# EAGLE design 5V-3.3VSupply_USB (EAGLE 7.2.0)
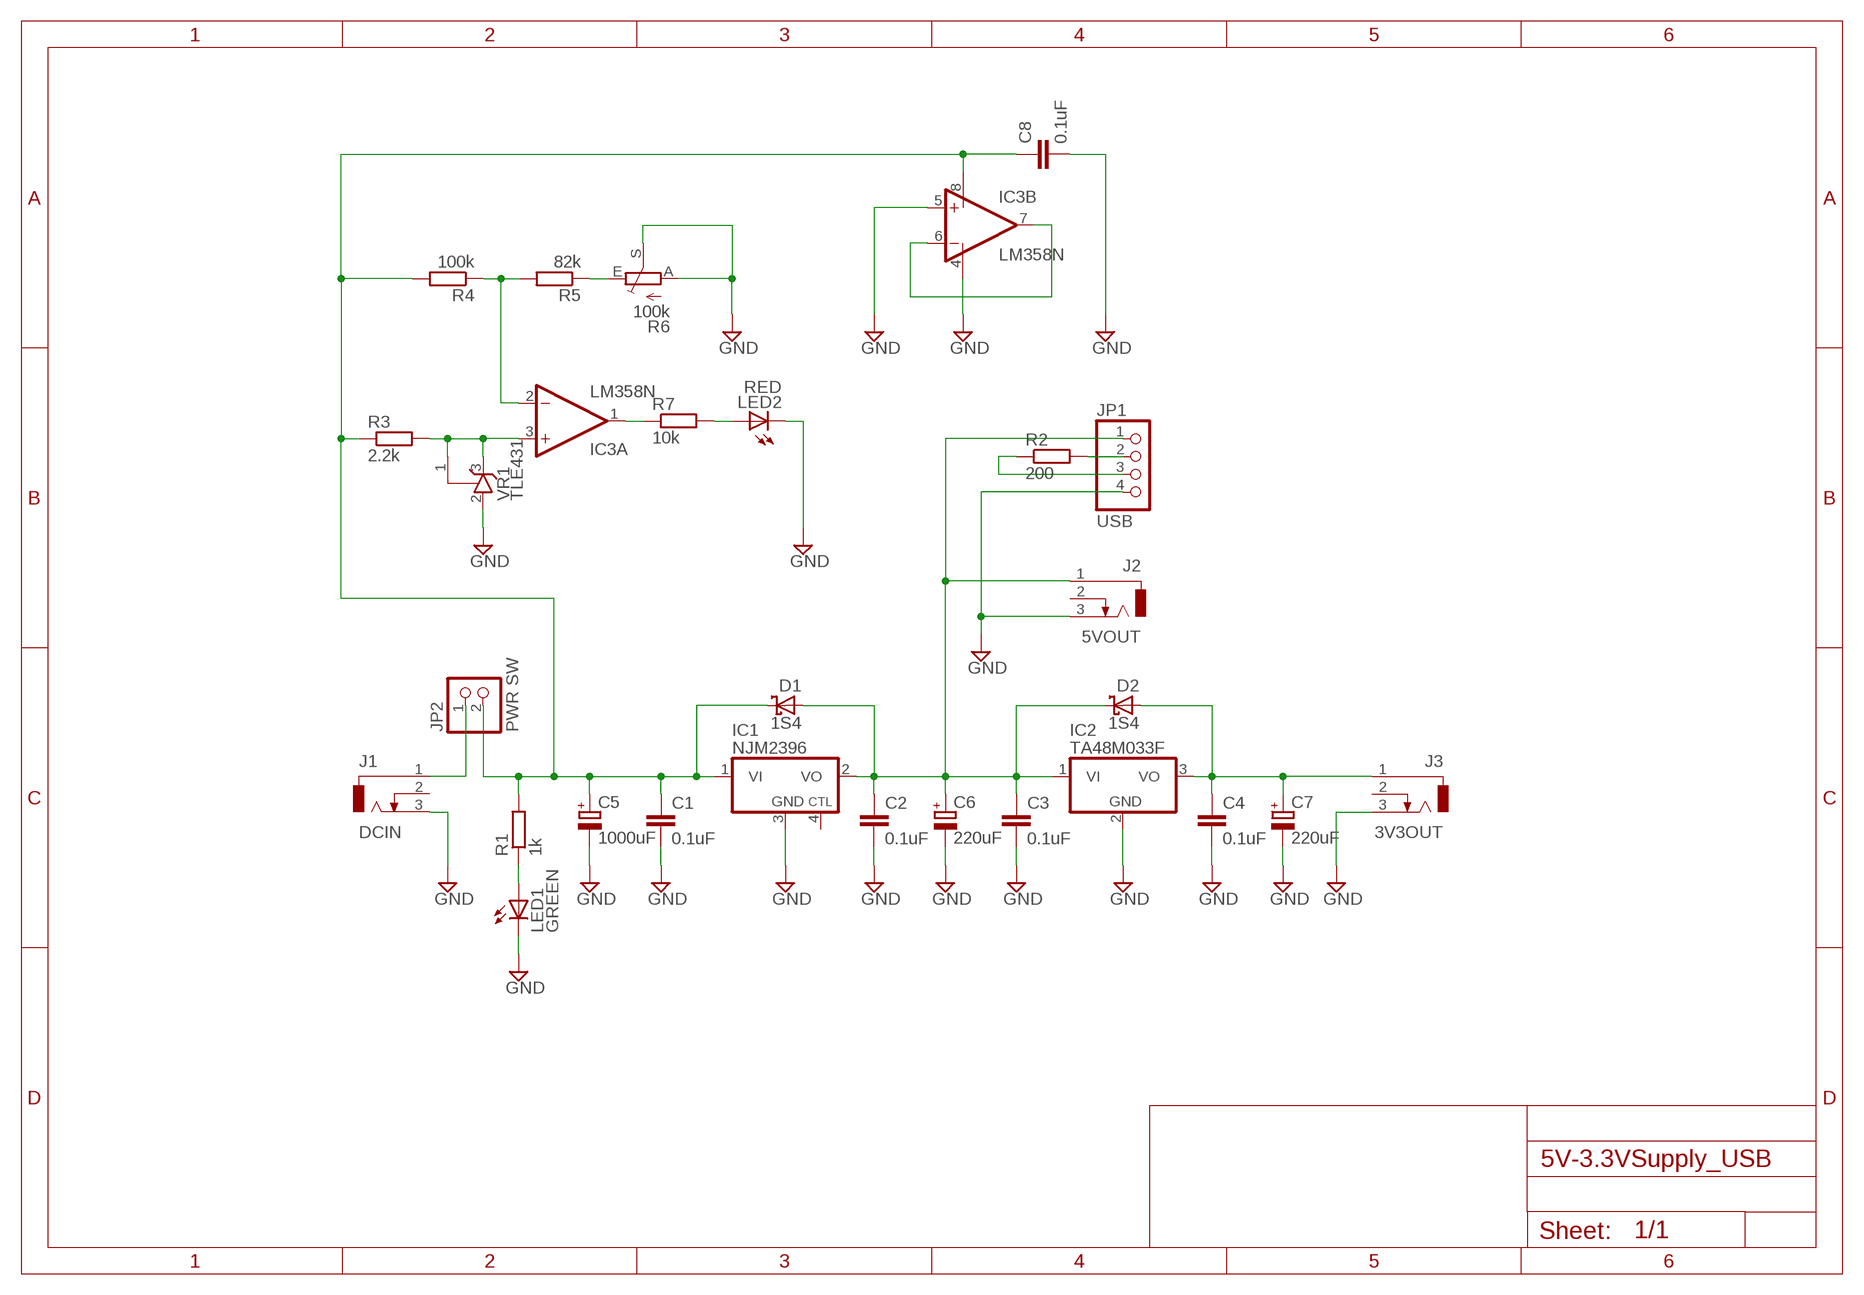
[diagram p0: schematic, sheet 1]

## Parts
C1  0.1uF  C-EU025-024X044  [C025-024X044]
C2  0.1uF  C-EU025-024X044  [C025-024X044]
C3  0.1uF  C-EU025-024X044  [C025-024X044]
C4  0.1uF  C-EU025-024X044  [C025-024X044]
C5  1000uF  CPOL-EUTT5D11L  [TT5D11L]
C6  220uF  CPOL-EUE5-8.5  [E5-8,5]
C7  220uF  CPOL-EUE5-8.5  [E5-8,5]
C8  0.1uF  C-EU025-024X044  [C025-024X044]
D1  1S4  1N5817-B  [DO41-7.6]
D2  1S4  1N5817-B  [DO41-7.6]
IC1  NJM2396  [TO220-4H]
IC2  TA48M033F  7805TV  [TO220V]
IC3  LM358N  [DIL08]
J1  DCIN  DCJ0303  [DCJ0303]
J2  5VOUT  DCJ0303  [DCJ0303]
J3  3V3OUT  DCJ0303  [DCJ0303]
JP1  USB  PINHD-1X4  [1X04]
JP2  PWR SW  PINHD-1X2  [1X02]
LED1  GREEN  LED3MM  [LED3MM]
LED2  RED  LED3MM  [LED3MM]
R1  1k  R-EU_0207/7  [0207/7]
R2  200  R-EU_0207/2V  [0207/2V]
R3  2.2k  R-EU_0207/7  [0207/7]
R4  100k  R-EU_0207/7  [0207/7]
R5  82k  R-EU_0207/7  [0207/7]
R6  100k  TRIM_EU-CT6  [CT6]
R7  10k  R-EU_0207/7  [0207/7]
VR1  TLE431  TL431-INLINE  [TO226AA]

## Nets
GND: C1.2 C2.2 C3.2 C4.2 C5.- C6.- C7.- C8.2 IC1.3(GND) IC2.2(GND) IC3.4(P:V-) IC3.5(B:+IN) J1.3 J2.3 J3.3 JP1.4 LED1.K(C) LED2.K(C) R6.A R6.S VR1.2(A)
N$1: C1.1 C5.+ C8.1 D1.C IC1.1(VI) IC3.8(P:V+) JP2.2 R1.2 R3.1 R4.2
N$2: C2.1 C3.1 C6.+ D1.A D2.C IC1.2(VO) IC2.1(VI) J2.1 JP1.1
N$3: C4.1 C7.+ D2.A IC2.3(VO) J3.1
N$4: LED1.A R1.1
N$5: J1.1 JP2.1
N$6: JP1.2 R2.2
N$7: JP1.3 R2.1
N$8: IC3.3(A:+IN) R3.2 VR1.1(R) VR1.3(C)
N$9: IC3.2(A:-IN) R4.1 R5.2
N$10: R5.1 R6.E
N$11: IC3.1(A:OUT) R7.1
N$12: LED2.A R7.2
N$13: IC3.6(B:-IN) IC3.7(B:OUT)
Unconnected: IC1.4(CTL) J1.2 J2.2 J3.2

## Library data of the parts
C1-C4 C8 = rcl:C-EU: CAPACITOR, European symbol
C5-C7 = rcl:CPOL-EU: POLARIZED CAPACITOR, European symbol
D1 D2 = diode:1N581*: 1.0A SCHOTTKY BARRIER RECTIFIER Source: http://www.diodes.com/datasheets/ds23001.pdf
IC1 = mylib2:NJM2396
IC2 = linear:78*: Positive VOLTAGE REGULATOR Source: http://cache.national.com/ds/LM/LM78L05.pdf http://www.fairchildsemi.com/ds/LM/LM7805.pdf
IC3 = linear:LM358: OP AMP also LM158; LM258; LM2904 Source: http://cache.national.com/ds/LM/LM158.pdf
J1-J3 = con-jack:DCJ0303: DC POWER JACK Source: DCJ0303.pdf; OC_FARNELL: unknown; OC_NEWARK: unknown
JP1 = pinhead:PINHD-1X4: PIN HEADER
JP2 = pinhead:PINHD-1X2: PIN HEADER
LED1 LED2 = led:LED: LED OSRAM: - CHIPLED LG R971, LG N971, LY N971, LG Q971, LY Q971, LO R971, LY R971 LH N974, LH R974 LS Q976, LO Q976, LY Q976 LO Q996 - Hyper CHIPLED LW Q18S LB Q993, LB Q99A, LB R99A - SideLED LS A670, LO A670, LY A670, LG A670, LP A670 LB A673, LV A673, LT A673, LW A673 LH A674 LY A675 LS A676, LA A676, LO A676, LY A676, LW A676 LS A679, LY A679, LG A679 - Hyper Micro SIDELED® LS Y876, LA Y876, LO Y876, LY Y876 LT Y87S - SmartLED LW L88C, LW L88S LB L89C, LB L89S, LG L890 LS L89K, LO L89K, LY L89K LS L896, LA L896, LO L896, LY L896 - TOPLED LS T670, LO T670, LY T670, LG T670, LP T670 LSG T670, LSP T670, LSY T670, LOP T670, LYG T670 LG T671, LOG T671, LSG T671 LB T673, LV T673, LT T673, LW T673 LH T674 LS T676, LA T676, LO T676, LY T676, LB T676, LH T676, LSB T676, LW T676 LB T67C, LV T67C, LT T67C, LS T67K, LO T67K, LY T67K, LW E67C LS E67B, LA E67B, LO E67B, LY E67B, LB E67C, LV E67C, LT E67C LW T67C LS T679, LY T679, LG T679 LS T770, LO T770, LY T770, LG T770, LP T770 LB T773, LV T773, LT T773, LW T773 LH T774 LS E675, LA E675, LY E675, LS T675 LS T776, LA T776, LO T776, LY T776, LB T776 LHGB T686 LT T68C, LB T68C - Hyper Mini TOPLED® LB M676 - Mini TOPLED Santana® LG M470 LS M47K, LO M47K, LY M47K Source: http://www.osram.convergy.de LUXEON: - LUMILED® LXK2-PW12-R00, LXK2-PW12-S00, LXK2-PW14-U00, LXK2-PW14-V00 LXK2-PM12-R00, LXK2-PM12-S00, LXK2-PM14-U00 LXK2-PE12-Q00, LXK2-PE12-R00, LXK2-PE12-S00, LXK2-PE14-T00, LXK2-PE14-U00 LXK2-PB12-K00, LXK2-PB12-L00, LXK2-PB12-M00, LXK2-PB14-N00, LXK2-PB14-P00, LXK2-PB14-Q00 LXK2-PR12-L00, LXK2-PR12-M00, LXK2-PR14-Q00, LXK2-PR14-R00 LXK2-PD12-Q00, LXK2-PD12-R00, LXK2-PD12-S00 LXK2-PH12-R00, LXK2-PH12-S00 LXK2-PL12-P00, LXK2-PL12-Q00, LXK2-PL12-R00 Source: www.luxeon.com KINGBRIGHT: KA-3528ASYC Source: www.kingbright.com
R1-R5 R7 = rcl:R-EU_: RESISTOR, European symbol
R6 = pot:TRIM_EU-: POTENTIOMETER
VR1 = mylib2:TL431-INLINE

## Board
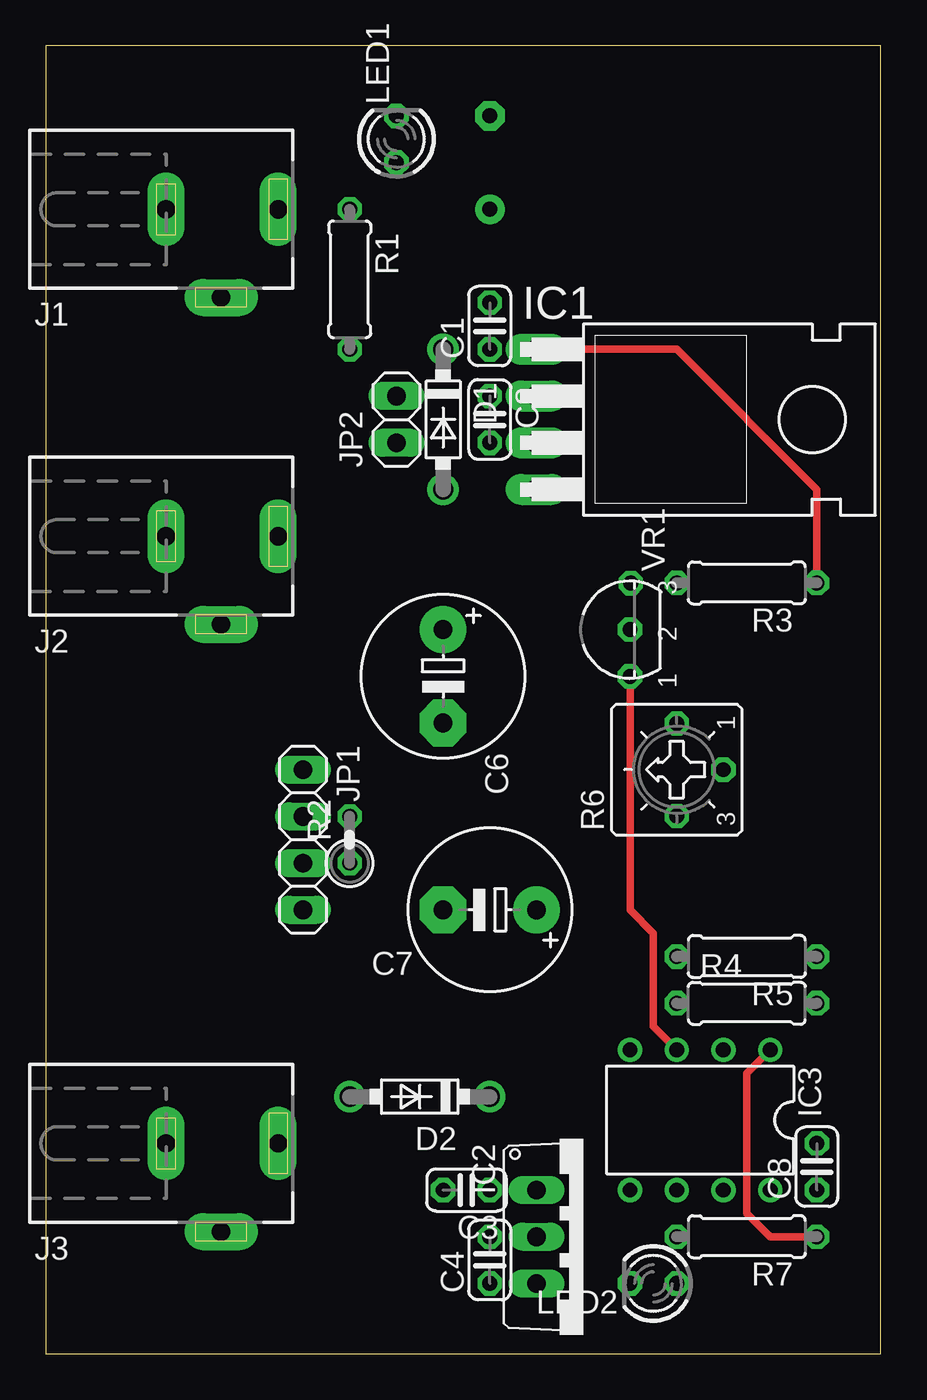
[diagram p1: board, top side]
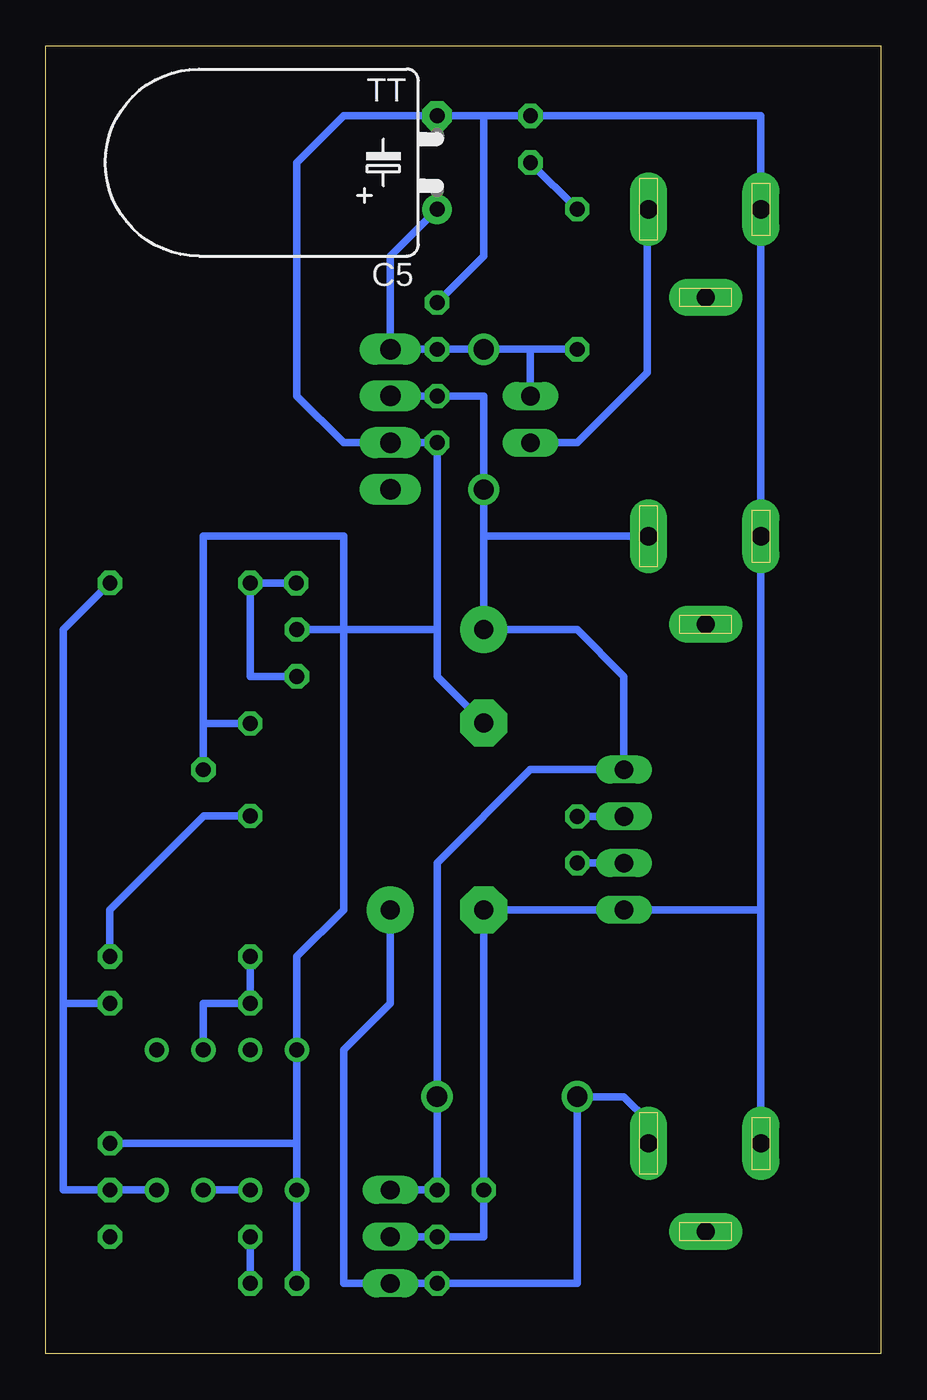
[diagram p2: board, bottom side, seen from below]

Size 45.39 x 71.11 mm. Coordinates in mm from the lower left corner, seen from the top.
Outline: 0,0 45.39,0 45.39,71.11 0,71.11 0,0
Copper layers (1*16): Top 0.035mm / dielectric 1.5mm / Bottom 0.035mm
Design rules "default": minimum track width 10mil, minimum drill 24mil, track to track 8mil, track to pad 8mil, pad to pad 8mil, via to via 8mil, smd to smd 8mil, copper to edge 40mil, drill to drill 8mil, minimum pad ring 10mil, minimum via ring 8mil, stop-mask expansion 4mil, vias tented up to drill 0mil, thermal gap 10mil
tKeepout: area -1.3,16.5 to 15.2,39.4
bKeepout: area 1.3,1.3 to 3.8,3.8; area 41.9,1.3 to 44.4,3.8; area 1.3,67.3 to 3.8,69.9; area 41.9,67.3 to 44.4,69.9; area 17.8,68.6 to 40.6,71.1

### Footprints (pad centres in the part's own frame; a part is rotated, then mirrored left to right if it is on the bottom)
C025-024X044 = drill 0.813 octagon: 1 -1.27,0; 2 1.27,0
TT5D11L = drill 0.813 pad 1.6: + -2.54,0 | drill 0.813 pad 1.6 octagon: - 2.54,0
E5-8,5 = drill 1.016 pad 2.54: + -2.54,0 | drill 1.016 pad 2.54 octagon: - 2.54,0
DO41-7.6 = drill 1.1 pad 1.7: A 3.81,0; C -3.81,0
TO220-4H = drill 1.118 long: 1 -3.81,-12.7; 2 -1.27,-12.7; 3 1.27,-12.7; 4 3.81,-12.7
TO220V = drill 1.016 long: 1 -2.54,-2.54; 2 0,-2.54; 3 2.54,-2.54
DIL08 = drill 0.813 pad 1.27: 1 -3.81,-3.81; 2 -1.27,-3.81; 3 1.27,-3.81; 4 3.81,-3.81; 5 3.81,3.81; 6 1.27,3.81; 7 -1.27,3.81; 8 -3.81,3.81
DCJ0303 = drill 1 pad 2 long: 1 0,3.1; 2 4.8,0; 3 0,-3
1X04 = drill 1.016 long: 1 -3.81,0; 2 -1.27,0; 3 1.27,0; 4 3.81,0
1X02 = drill 1.016 long: 1 -1.27,0; 2 1.27,0
LED3MM = drill 0.813 octagon: A -1.27,0; K 1.27,0
0207/7 = drill 0.813 octagon: 1 -3.81,0; 2 3.81,0
0207/2V = drill 0.813 octagon: 1 -1.27,0; 2 1.27,0
CT6 = drill 0.813 octagon: A 2.515,0; E -2.515,0; S 0,-2.54
TO226AA = drill 0.813 octagon: 1 -2.544,0; 2 0.001,0; 3 2.524,-0.04

### Placement (x,y rotation side)
C1  24.13,55.88 90 top
C2  24.13,50.8 270 top
C3  22.86,8.89 180 top
C4  24.13,5.08 90 top
C5  24.13,64.77 90 bottom
C6  21.59,36.83 270 top
C7  24.13,24.13 180 top
C8  41.91,10.16 90 top
D1  21.59,50.8 270 top
D2  20.32,13.97 180 top
IC1  39.37,50.8 270 top
IC2  29.21,6.35 270 top
IC3  35.56,12.7 180 top
J1  9.53,62.23 270 top
J2  9.53,44.45 270 top
J3  9.53,11.43 270 top
JP1  13.97,27.94 270 top
JP2  19.05,50.8 90 top
LED1  19.05,66.04 90 top
LED2  33.02,3.81 180 top
R1  16.51,58.42 270 top
R2  16.51,27.94 90 top
R3  38.1,41.91 180 top
R4  38.1,19.05 0 top
R5  38.1,21.59 180 top
R6  34.29,31.75 90 top
R7  38.1,6.35 180 top
VR1  31.75,39.37 90 top

### Tracks (layer width: path | path; a pad name or v marks a point on that pad's centre or on a via)
GND
  Bottom 0.406: 21.59,67.31 LED1.K 6.53,67.31 J1.3 J2.3 6.53,24.13 | 21.59,67.31 C5.- 29.21,67.31 31.75,64.77 31.75,52.07 29.21,49.53 IC1.3 C2.2 24.13,39.37 | C1.2 21.59,59.69 21.59,67.31 | C6.- 24.13,36.83 24.13,39.37 | J3.3 6.53,24.13 | IC2.2 C4.2 21.59,6.35 C3.2 C7.- JP1.4 6.53,24.13 | 31.75,11.43 IC3.5 LED2.K | C8.2 31.75,11.43 | VR1.2 29.21,39.37 | 29.21,39.37 24.13,39.37 | R6.S 36.83,34.29 | 36.83,34.29 36.83,44.45 29.21,44.45 29.21,39.37 | 29.21,39.37 29.21,24.13 31.75,21.59 IC3.4 31.75,11.43 | R6.A 36.8,34.26 36.83,34.29
N$1
  Top 0.406: IC1.1 34.29,54.61 41.91,46.99 R3.1
  Bottom 0.406: C5.+ 26.67,59.69 IC1.1 C1.1 D1.C 19.05,54.61 | R3.1 44.45,39.37 44.45,19.05 | 44.45,19.05 44.45,8.89 C8.1 IC3.8 | R4.2 44.45,19.05 | R1.2 19.05,54.61 | JP2.2 19.05,54.61
N$2
  Bottom 0.406: IC1.2 C2.1 21.59,52.07 D1.A 21.59,44.45 | 21.59,44.45 C6.+ 16.51,39.37 13.97,36.83 JP1.1 19.05,31.75 24.13,26.67 D2.C C3.1 IC2.1 | J2.1 21.59,44.45
N$3
  Bottom 0.406: C7.+ 26.67,19.05 29.21,16.51 29.21,3.81 IC2.3 C4.1 16.51,3.81 D2.A 13.97,13.97 12.62,12.62 J3.1
N$4
  Bottom 0.406: R1.1 LED1.A
N$5
  Bottom 0.406: JP2.1 16.51,49.53 12.7,53.34 12.7,62.15 J1.1
N$6
  Bottom 0.406: R2.2 JP1.2
N$7
  Bottom 0.406: R2.1 JP1.3
N$8
  Top 0.406: IC3.3 33.02,17.78 33.02,22.86 31.75,24.13 VR1.1
  Bottom 0.406: VR1.3 34.27,41.89 R3.2 34.29,36.83 VR1.1
N$9
  Bottom 0.406: R5.2 R4.1 36.83,19.05 IC3.2
N$10
  Bottom 0.406: R6.E 36.8,29.23 41.91,24.13 R5.1
N$11
  Top 0.406: IC3.1 38.1,15.24 38.1,7.62 39.37,6.35 R7.1
N$12
  Bottom 0.406: LED2.A R7.2
N$13
  Bottom 0.406: IC3.6 IC3.7